# EAGLE design arduino shield (EAGLE 6.5.0)
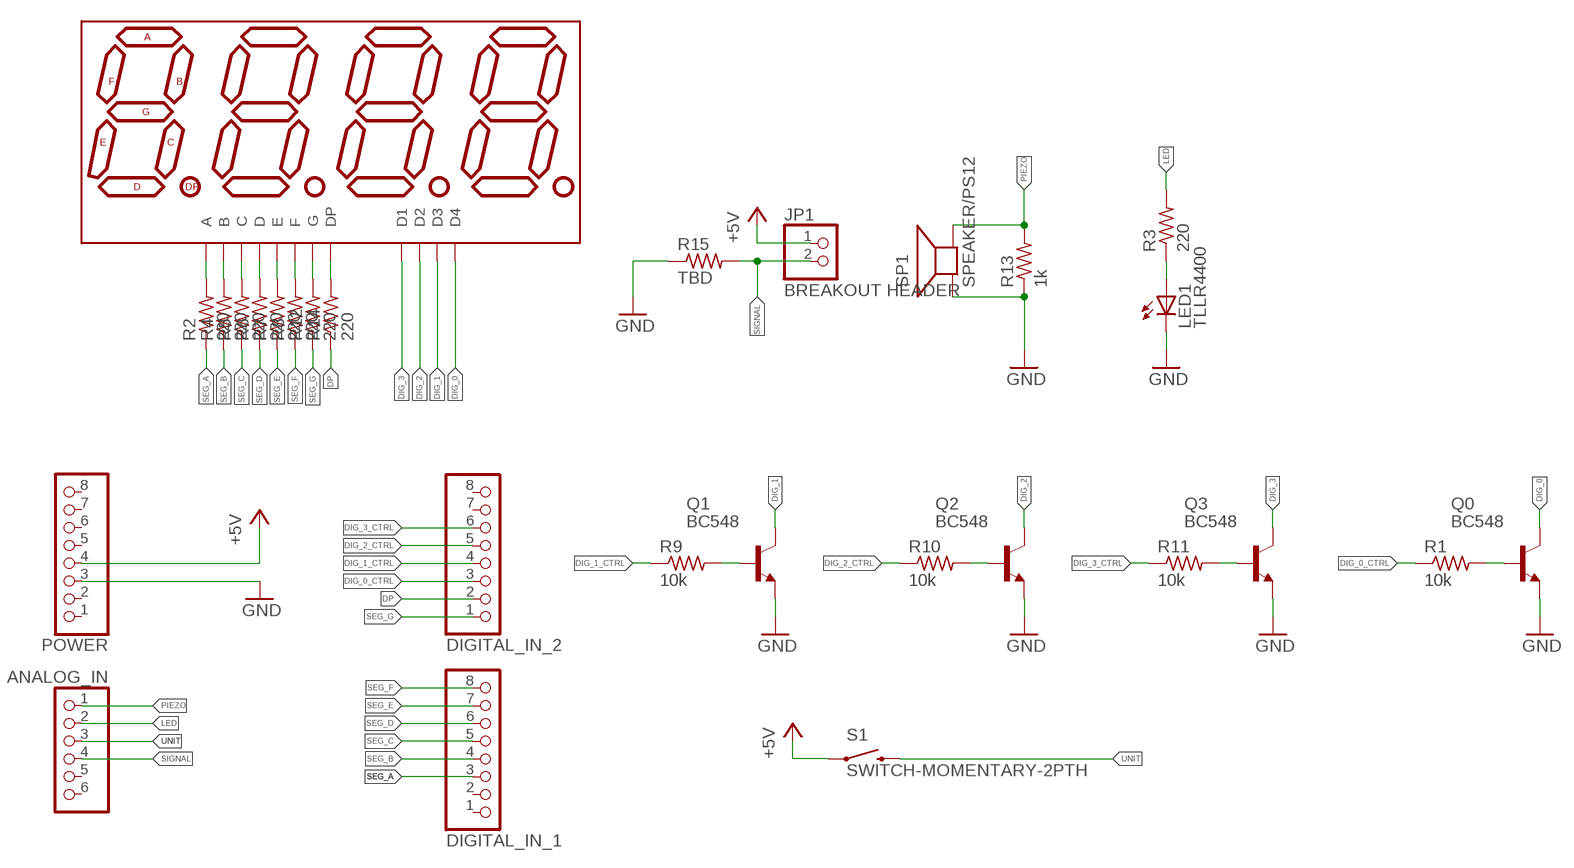
[diagram p0: schematic, sheet 1]

## Parts
ANALOG_IN  PINHD-1X6CB  [1X06-CLEANBIG]
DIGITAL_IN_1  PINHD-1X8CLEANBIG  [1X08-CLEANBIG]
DIGITAL_IN_2  PINHD-1X8CLEANBIG  [1X08-CLEANBIG]
DISP1  7-SEGMENT-4DIGIT-COUNTERPTH  [7-SEGMENT-4DIGIT-COUNTER]
JP1  BREAKOUT HEADER  PINHD-1X2  [1X02]
LED1  TLLR4400  [LED3MM]
POWER  PINHD-1X8CLEANBIG  [1X08-CLEANBIG]
Q0  BC548  [TO92-EBC]
Q1  BC548  [TO92-EBC]
Q2  BC548  [TO92-EBC]
Q3  BC548  [TO92-EBC]
R1  10k  R-US_0207/10  [0207/10]
R2  220  R-US_0207/10  [0207/10]
R3  220  R-US_0207/10  [0207/10]
R4  220  R-US_0207/10  [0207/10]
R5  220  R-US_0207/10  [0207/10]
R6  220  R-US_0207/10  [0207/10]
R7  220  R-US_0207/10  [0207/10]
R8  220  R-US_0207/10  [0207/10]
R9  10k  R-US_0207/10  [0207/10]
R10  10k  R-US_0207/10  [0207/10]
R11  10k  R-US_0207/10  [0207/10]
R12  220  R-US_0207/10  [0207/10]
R13  1k  R-US_0207/10  [0207/10]
R14  220  R-US_0207/10  [0207/10]
R15  TBD  R-US_0207/10  [0207/10]
S1  SWITCH-MOMENTARY-2PTH  [TACTILE-PTH]
SP1  SPEAKER/PS12  [PS12]

## Nets
+5V: JP1.1 POWER.4 S1.1
DIG_0: DISP1.6(D4) Q0.C
DIG_0_CTRL: DIGITAL_IN_2.3 R1.1
DIG_1: DISP1.8(D3) Q1.C
DIG_1_CTRL: DIGITAL_IN_2.4 R9.1
DIG_2: DISP1.9(D2) Q2.C
DIG_2_CTRL: DIGITAL_IN_2.5 R10.1
DIG_3: DISP1.12(D1) Q3.C
DIG_3_CTRL: DIGITAL_IN_2.6 R11.1
DP: DIGITAL_IN_2.2 R14.1
GND: LED1.K(C) POWER.3 Q0.E Q1.E Q2.E Q3.E R13.1 R15.1 SP1.P$1(+)
LED: ANALOG_IN.2 R3.2
N$1: Q0.B R1.2
N$3: LED1.A R3.1
N$4: DISP1.11(A) R2.2
N$5: DISP1.7(B) R4.2
N$6: DISP1.4(C) R5.2
N$7: DISP1.2(D) R6.2
N$8: DISP1.1(E) R7.2
N$9: Q1.B R9.2
N$10: Q2.B R10.2
N$11: Q3.B R11.2
N$12: DISP1.10(F) R8.2
N$13: DISP1.5(G) R12.2
N$14: DISP1.3(DP) R14.2
PIEZO: ANALOG_IN.1 R13.2 SP1.P$2(-)
SEG_A: DIGITAL_IN_1.3 R2.1
SEG_B: DIGITAL_IN_1.4 R4.1
SEG_C: DIGITAL_IN_1.5 R5.1
SEG_D: DIGITAL_IN_1.6 R6.1
SEG_E: DIGITAL_IN_1.7 R7.1
SEG_F: DIGITAL_IN_1.8 R8.1
SEG_G: DIGITAL_IN_2.1 R12.1
SIGNAL: ANALOG_IN.4 JP1.2 R15.2
UNIT: ANALOG_IN.3 S1.3
Unconnected: ANALOG_IN.5 ANALOG_IN.6 DIGITAL_IN_1.1 DIGITAL_IN_1.2 DIGITAL_IN_2.7 DIGITAL_IN_2.8 POWER.1 POWER.2 POWER.5 POWER.6 POWER.7 POWER.8

## Library data of the parts
ANALOG_IN = adafruit:PINHD-1X6: PIN HEADER
DIGITAL_IN_1 DIGITAL_IN_2 POWER = adafruit:PINHD-1X8: PIN HEADER
DISP1 = Sparkfun Displays - Custom:7-SEGMENT-4DIGIT-COUNTER
JP1 = pinhead:PINHD-1X2: PIN HEADER
LED1 = led:TLLR4400: Low Current (2mA) LED 3 mm Tinted Diffused Package color RED Source: Data sheet <http://www.farnell.com/datasheets/391100.pdf>; MF: VISHAY SEMICONDUCTOR; OC_FARNELL: 1612437
Q0 Q1-Q3 = transistor-npn:BC548*: NPN Transistor
R1-R15 = resistor:R-US_: RESISTOR, American symbol
S1 = SparkFun-Electromechanical:SWITCH-MOMENTARY-2: Various NO switches- pushbuttons, reed, etc; PROD_ID: SWCH-08441
SP1 = Adafruit - Custom:SPEAKER: SPEAKER Source: Buerklin Added PS12 (for part # PS1240 piezo) http://www.ladyada.net/library/pcb/eaglelibrary.html

## Net classes
0 default: clearance 0.205 mm

## Board
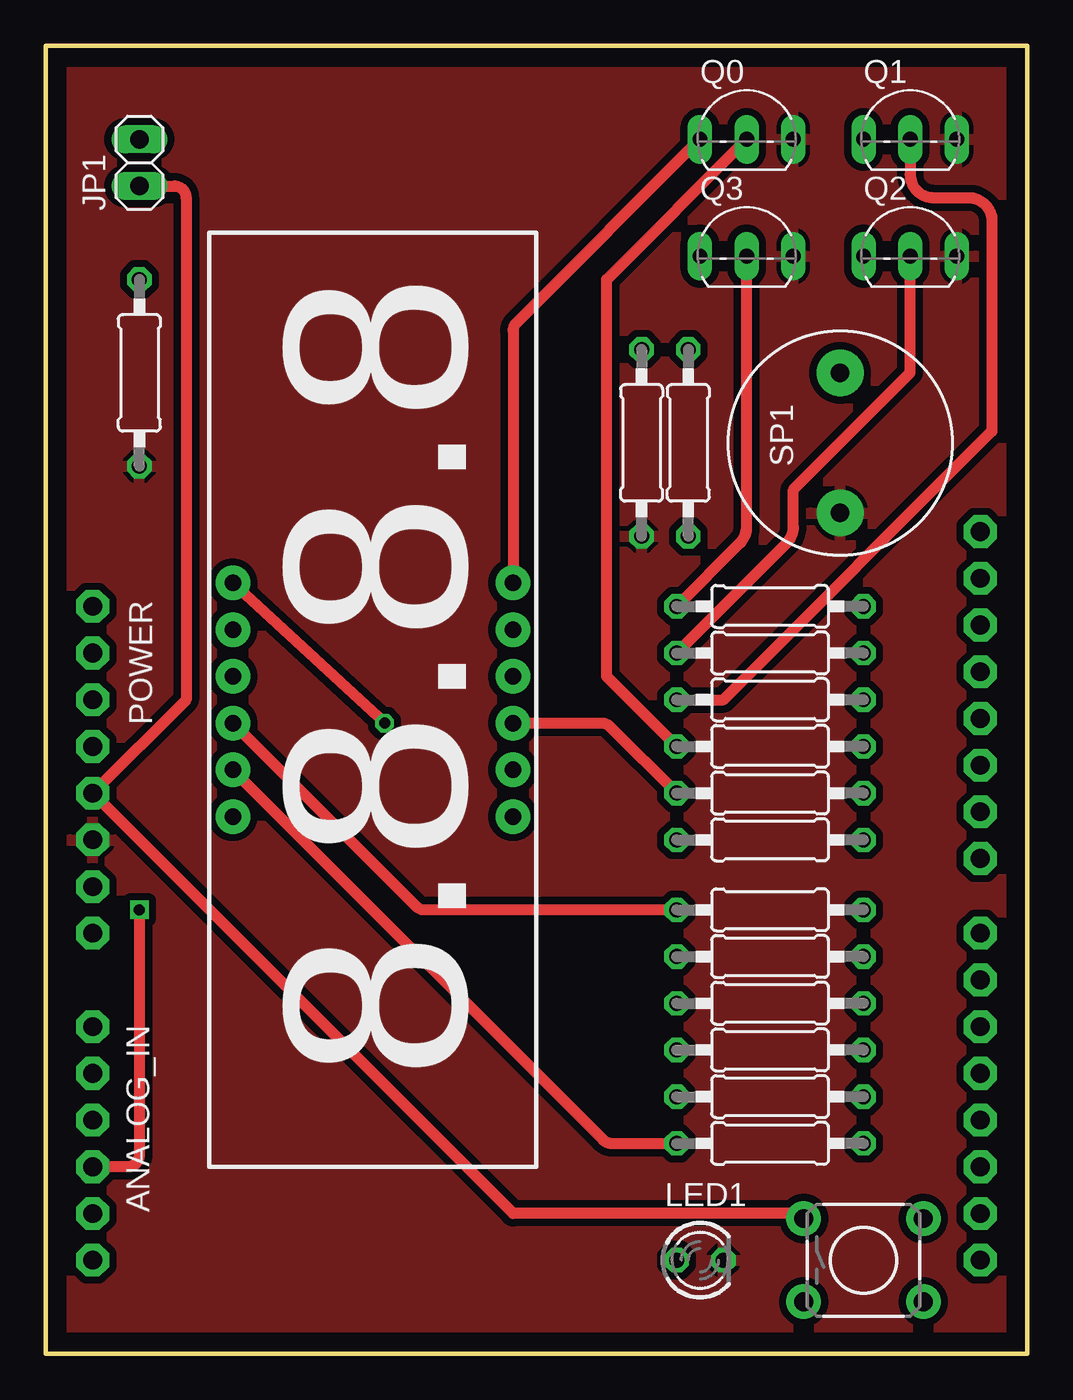
[diagram p1: board, top side]
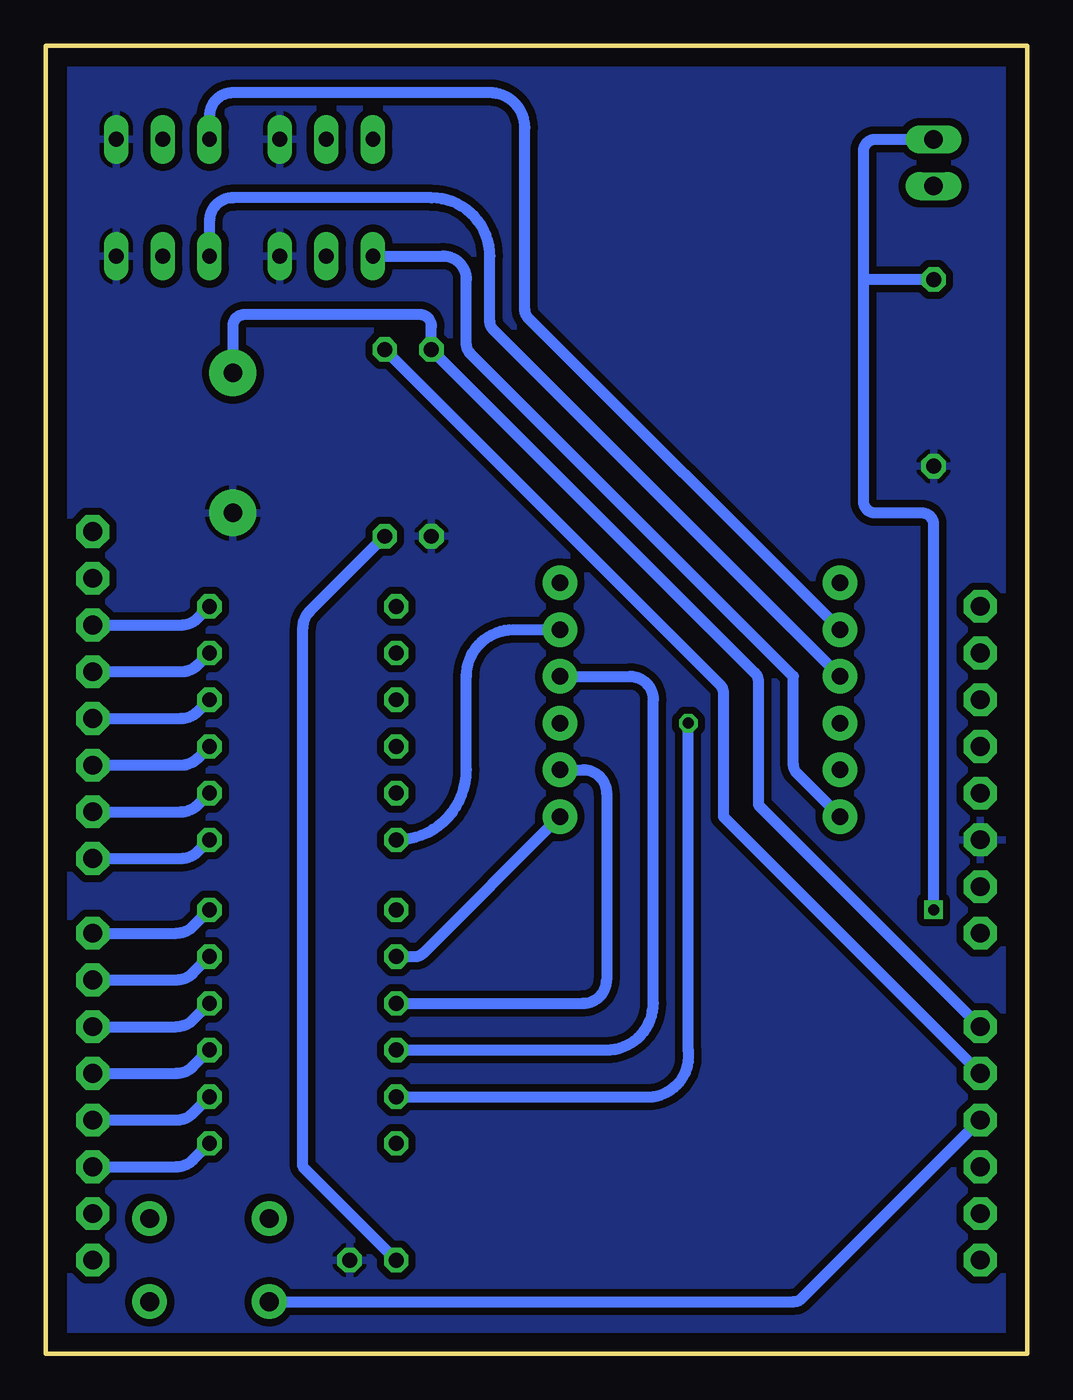
[diagram p2: board, bottom side, seen from below]

Size 53.34 x 71.12 mm. Coordinates in mm from the lower left corner, seen from the top.
Outline: 0,71.12 53.34,71.12 53.34,0 0,0 0,71.12
Copper layers (1*16): Top 0.035mm / dielectric 1.5mm / Bottom 0.035mm
Design rules "arduino shield *": minimum track width 0.4mm, minimum drill 24mil, track to track 0.4mm, track to pad 0.205mm, pad to pad 0.205mm, via to via 0.205mm, smd to smd 8mil, copper to edge 40mil, drill to drill 8mil, minimum pad ring 10mil, minimum via ring 8mil, stop-mask expansion 4mil, vias tented up to drill 0mil, thermal gap 10mil

### Footprints (pad centres in the part's own frame; a part is rotated, then mirrored left to right if it is on the bottom)
1X06-CLEANBIG = drill 1.016 pad 1.778 octagon: 1 -6.35,0; 2 -3.81,0; 3 -1.27,0; 4 1.27,0; 5 3.81,0; 6 6.35,0
1X08-CLEANBIG = drill 1.016 pad 1.778 octagon: 1 -8.89,0; 2 -6.35,0; 3 -3.81,0; 4 -1.27,0; 5 1.27,0; 6 3.81,0; 7 6.35,0; 8 8.89,0
7-SEGMENT-4DIGIT-COUNTER = drill 0.9 pad 1.88: 1 -6.35,-7.62; 2 -3.81,-7.62; 3 -1.27,-7.62; 4 1.27,-7.62; 5 3.81,-7.62; 6 6.35,-7.62; 7 6.35,7.62; 8 3.81,7.62; 9 1.27,7.62; 10 -1.27,7.62; 11 -3.81,7.62; 12 -6.35,7.62
1X02 = drill 1.016 long: 1 -1.27,0; 2 1.27,0
LED3MM = drill 0.813 octagon: A -1.27,0; K 1.27,0
TO92-EBC = drill 0.813 long: B 0,-1.27; C -2.54,-1.27; E 2.54,-1.27
0207/10 = drill 0.813 octagon: 1 -5.08,0; 2 5.08,0
TACTILE-PTH = drill 1.016 pad 1.88: 1 -3.251,2.261; 2 3.251,2.261; 3 -3.251,-2.261; 4 3.251,-2.261
PS12 = drill 1 pad 2.54: P$1 -3.81,0; P$2 3.81,0

### Placement (x,y rotation side)
ANALOG_IN  2.54,11.43 270 top
DIGITAL_IN_1  50.8,13.97 90 top
DIGITAL_IN_2  50.8,35.81 90 top
DISP1  17.78,35.56 90 top
JP1  5.08,64.77 90 top
LED1  35.56,5.08 0 top
POWER  2.54,31.75 90 top
Q0  38.1,67.31 0 top
Q1  46.99,67.31 0 top
Q2  46.99,60.96 0 top
Q3  38.1,60.96 0 top
R1  39.37,33.02 180 top
R2  39.37,11.43 180 top
R3  34.92,49.53 90 top
R4  39.37,13.97 180 top
R5  39.37,16.51 180 top
R6  39.37,19.05 180 top
R7  39.37,21.59 180 top
R8  39.37,24.13 180 top
R9  39.37,35.56 180 top
R10  39.37,38.1 180 top
R11  39.37,40.64 180 top
R12  39.37,27.94 180 top
R13  32.38,49.53 90 top
R14  39.37,30.48 180 top
R15  5.08,53.34 90 top
S1  44.45,5.08 0 top
SP1  43.18,49.53 90 top

### Tracks (layer width: path | path; a pad name or v marks a point on that pad's centre or on a via)
+5V
  Top 0.61: S1.1 arc45 40.52,7.62 25.4,7.62 POWER.4 7.62,35.56 7.62,62.87 arc90 6.99,63.5 JP1.1
DIG_0
  Top 0.61: Q0.C 25.59,56.07 arc45 25.4,55.62 DISP1.6
DIG_0_CTRL
  Bottom 0.61: DIGITAL_IN_2.3 45.99,32 arc-45 45.09,32.38 R1.1
DIG_1
  Bottom 0.61: Q1.C 44.45,67.31 arc90 43.18,68.58 29.21,68.58 arc90 27.3,66.67 27.3,56.78 arc-45 27.12,56.33 DISP1.8
DIG_1_CTRL
  Bottom 0.61: DIGITAL_IN_2.4 45.99,34.54 arc-45 45.09,34.92 R9.1
DIG_2
  Bottom 0.61: Q2.C 44.45,61.59 arc90 43.18,62.87 32.38,62.87 arc90 29.21,59.69 29.21,56.14 arc-45 29.02,55.69 DISP1.9
DIG_2_CTRL
  Bottom 0.61: DIGITAL_IN_2.5 45.99,37.08 arc-45 45.09,37.46 R10.1
DIG_3
  Bottom 0.61: Q3.C 31.75,59.69 arc90 30.48,58.42 30.48,54.87 arc-45 30.29,54.42 12.7,36.83 12.7,32.01 arc-45 12.51,31.56 DISP1.12
DIG_3_CTRL
  Bottom 0.61: DIGITAL_IN_2.6 45.99,39.62 arc-45 45.09,40 R11.1
DP
  Bottom 0.61: DIGITAL_IN_2.2 45.99,29.46 arc-45 45.09,29.84 R14.1
GND
  pour Bottom: 0,71.12 53.34,71.12 53.34,0 0,0
  pour Top: 0,71.12 53.34,71.12 53.34,0 0,0
LED
  Bottom 0.61: R3.2 16.7,36.38 arc45 16.51,35.93 16.51,29.21 ANALOG_IN.2
N$1
  Top 0.61: R1.2 30.48,36.83 30.48,58.42 Q0.B
N$3
  Bottom 0.61: LED1.A 39.37,10.16 39.37,39.48 arc45 39,40.38 R3.1
N$4
  Top 0.61: DISP1.11 30.29,11.62 arc45 30.74,11.43 R2.2
N$5  (via drill 0.6 pad 0.81)
  Top 0.61: v18.41,34.29 DISP1.7
  Bottom 0.61: R4.2 20.32,13.97 arc-90 18.41,16.51 v18.41,34.29
N$6
  Bottom 0.61: DISP1.4 21.59,36.83 arc90 20.32,35.56 20.32,19.05 arc90 22.86,16.51 R5.2
N$7
  Bottom 0.61: R6.2 24.13,19.05 arc-90 22.86,20.32 22.86,30.48 arc-90 24.13,31.75 DISP1.2
N$8
  Bottom 0.61: R7.2 33.28,21.59 arc-45 32.83,21.78 DISP1.1
N$9
  Top 0.61: Q1.B 46.99,64.14 arc90 48.26,62.87 50.16,62.87 arc-90 51.43,61.59 51.43,50.16 36.83,35.56 R9.2
N$10
  Top 0.61: R10.2 40.27,44.08 arc45 40.64,44.98 40.64,46.99 46.99,53.34 Q2.B
N$11
  Top 0.61: R11.2 37.73,44.08 arc45 38.1,44.98 Q3.B
N$12
  Top 0.61: R8.2 20.58,24.13 arc-45 20.13,24.32 DISP1.10
N$13
  Bottom 0.61: R12.2 arc-90 30.48,31.75 30.48,36.83 arc90 27.94,39.37 DISP1.5
N$14
  Top 0.61: DISP1.3 30.22,34.29 arc-45 30.67,34.1 R14.2
PIEZO
  Bottom 0.61: ANALOG_IN.1 14.61,29.84 14.61,36.57 arc-45 14.79,37.02 R13.2 32.38,55.88 arc-90 33.02,56.52 42.54,56.52 arc-90 43.18,55.88 SP1.P$2
SEG_A
  Bottom 0.61: DIGITAL_IN_1.3 46.25,10.16 arc-45 45.35,10.53 R2.1
SEG_B
  Bottom 0.61: DIGITAL_IN_1.4 46.25,12.7 arc-45 45.35,13.07 R4.1
SEG_C
  Bottom 0.61: DIGITAL_IN_1.5 46.25,15.24 arc-45 45.35,15.61 R5.1
SEG_D
  Bottom 0.61: DIGITAL_IN_1.6 46.25,17.78 arc-45 45.35,18.15 R6.1
SEG_E
  Bottom 0.61: DIGITAL_IN_1.7 46.25,20.32 arc-45 45.35,20.69 R7.1
SEG_F
  Bottom 0.61: DIGITAL_IN_1.8 46.25,22.86 arc-45 45.35,23.23 R8.1
SEG_G
  Bottom 0.61: DIGITAL_IN_2.1 45.99,26.92 arc-45 45.09,27.3 R12.1
SIGNAL  (via drill 0.6)
  Top 0.61: v5.08,24.13 5.08,10.79 arc-90 4.45,10.16 ANALOG_IN.4
  Bottom 0.61: JP1.2 8.26,66.04 arc-90 8.89,65.41 8.89,58.42 | v5.08,24.13 5.08,45.09 arc-90 5.71,45.72 8.26,45.72 arc90 8.89,46.35 8.89,58.42 | R15.2 8.89,58.42
UNIT
  Bottom 0.61: S1.3 12.68,2.82 arc-45 12.24,3 ANALOG_IN.3